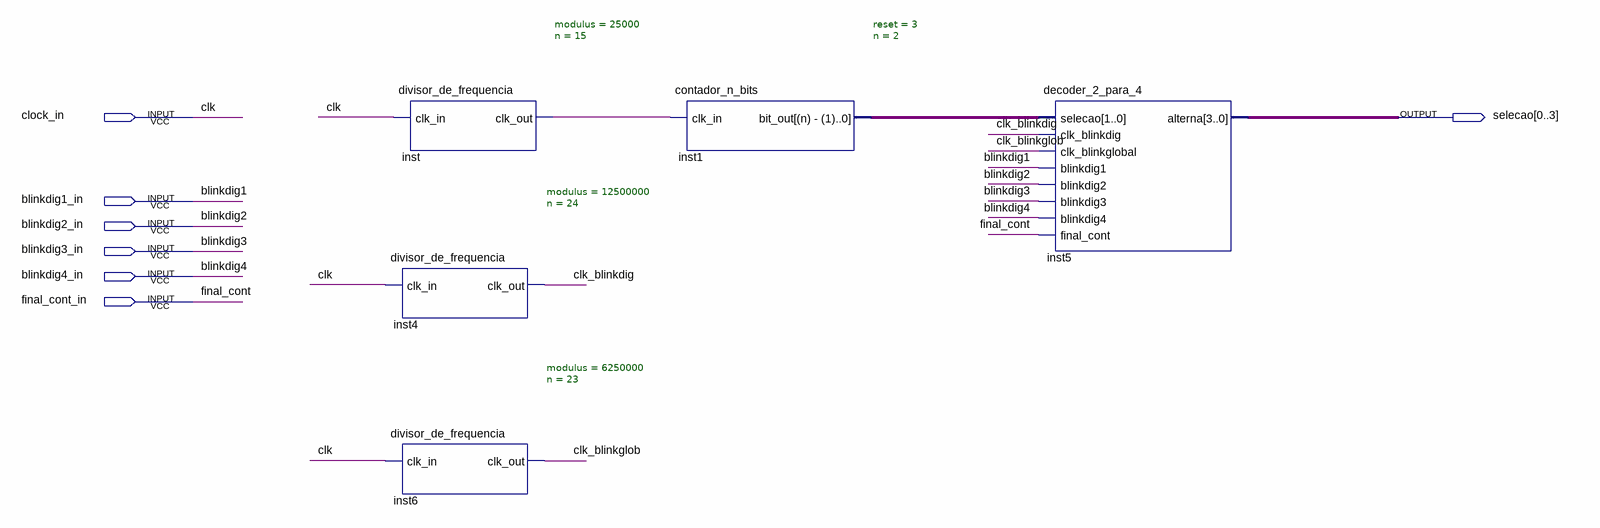
[diagram p0: schematic sheet]
// Quartus schematic Seletor_alimentacao_display.bdf as structural Verilog: 5 symbols, 7 pins
module Seletor_alimentacao_display (
  input  clock_in,
  input  blinkdig1_in,
  input  blinkdig2_in,
  input  blinkdig3_in,
  input  blinkdig4_in,
  input  final_cont_in,
  output [0:3] selecao
);

  wire clk_blinkdig, clk_blinkglob, inst_clk_out;
  wire [1:0] inst1_bit_out;

  divisor_de_frequencia #(.modulus(25000), .n(15)) inst (.clk_in(clock_in), .clk_out(inst_clk_out));
  divisor_de_frequencia #(.modulus(12500000), .n(24)) inst4 (.clk_in(clock_in), .clk_out(clk_blinkdig));
  divisor_de_frequencia #(.modulus(6250000), .n(23)) inst6 (.clk_in(clock_in), .clk_out(clk_blinkglob));
  contador_n_bits #(.reset(3), .n(2)) inst1 (.clk_in(inst_clk_out), .bit_out(inst1_bit_out));
  decoder_2_para_4 inst5 (
    .selecao(inst1_bit_out), .clk_blinkdig(clk_blinkdig), .clk_blinkglobal(clk_blinkglob),
    .blinkdig1(blinkdig1_in), .blinkdig2(blinkdig2_in), .blinkdig3(blinkdig3_in), .blinkdig4(blinkdig4_in),
    .final_cont(final_cont_in), .alterna(selecao));

  // Other names for the same wires on the sheet: blinkdig1 = blinkdig1_in; blinkdig2 = blinkdig2_in;
  //   blinkdig3 = blinkdig3_in; blinkdig4 = blinkdig4_in; clk = clock_in; final_cont = final_cont_in
endmodule
